# EasyEDA Pro project ProPrj_ADX_Core_v0_2026-04-30.epro

# Schematic Schematic

## Sheets
1 P1: Board Name: Board1; Create Date: 2026-04-08; Page Name: P1; Project Name: ADX_Core_v0; Schematic Name: Schematic; Update Date: 2026-04-29; Company: Furukawakikaku; Page Size: A4; Reviewed: Notebooklm; Version: V1.0
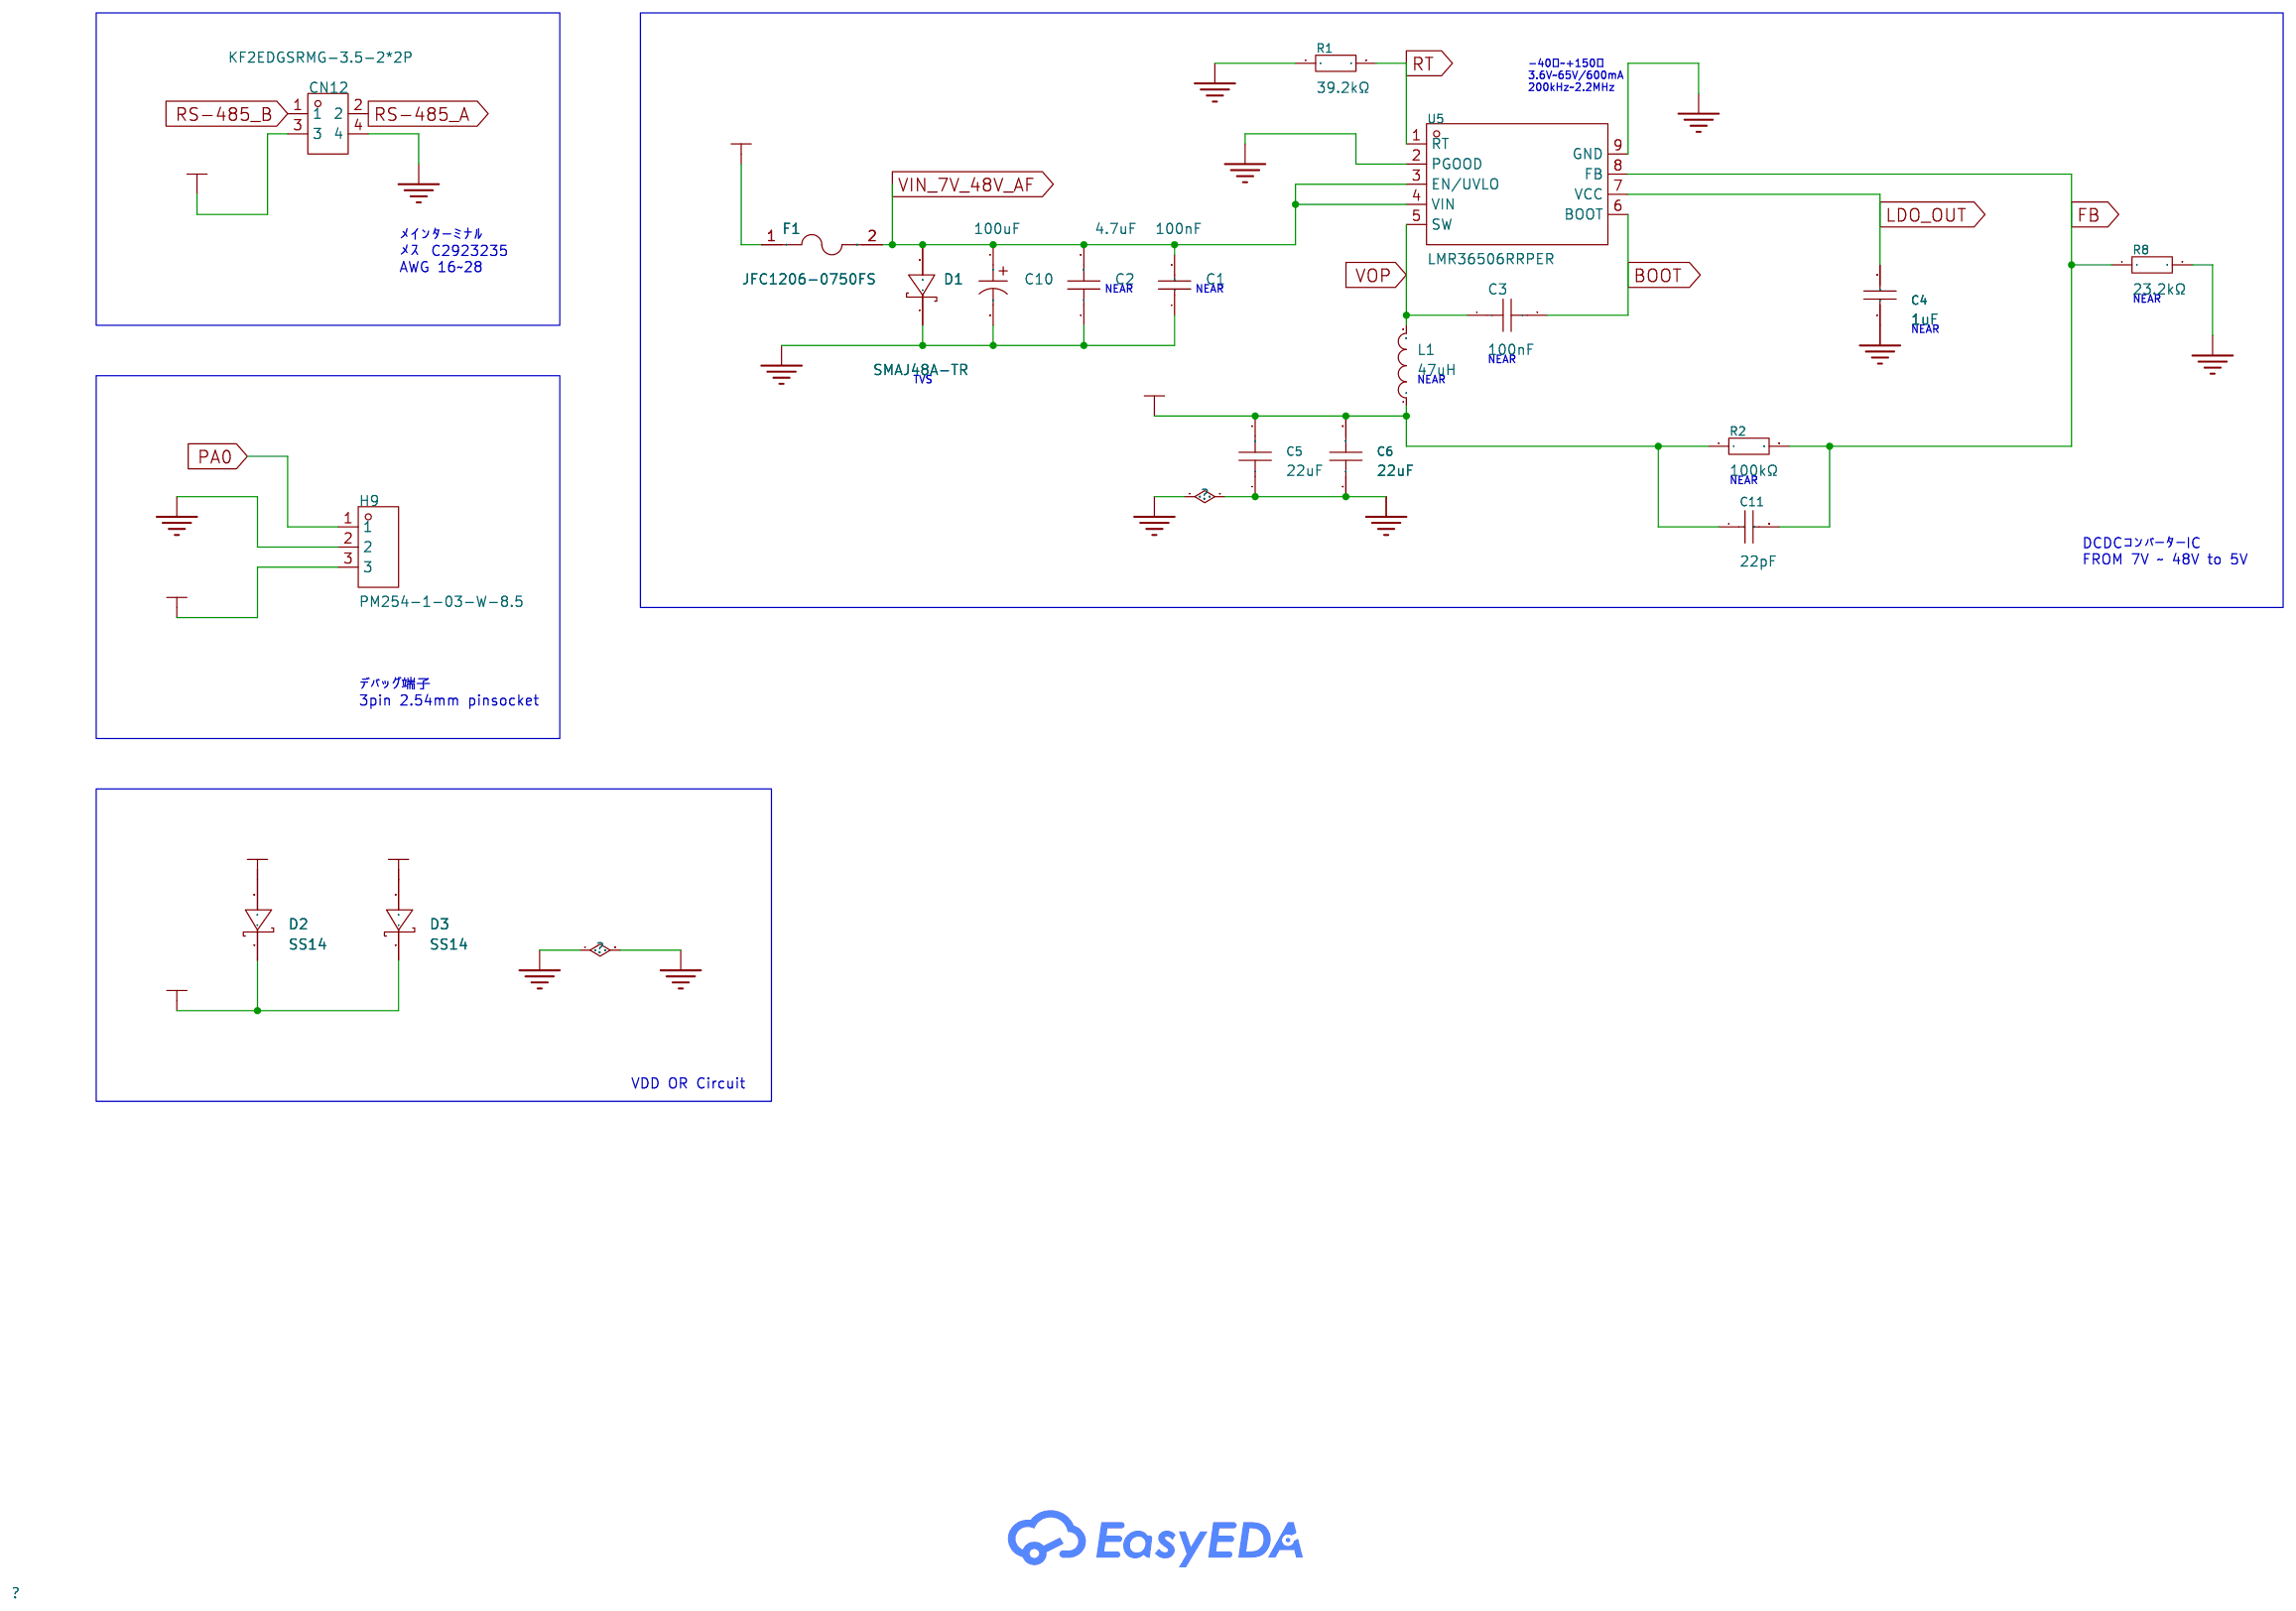
[diagram p0: P1]
2 P2: Page Name: P2; Company: Furukawakiakaku
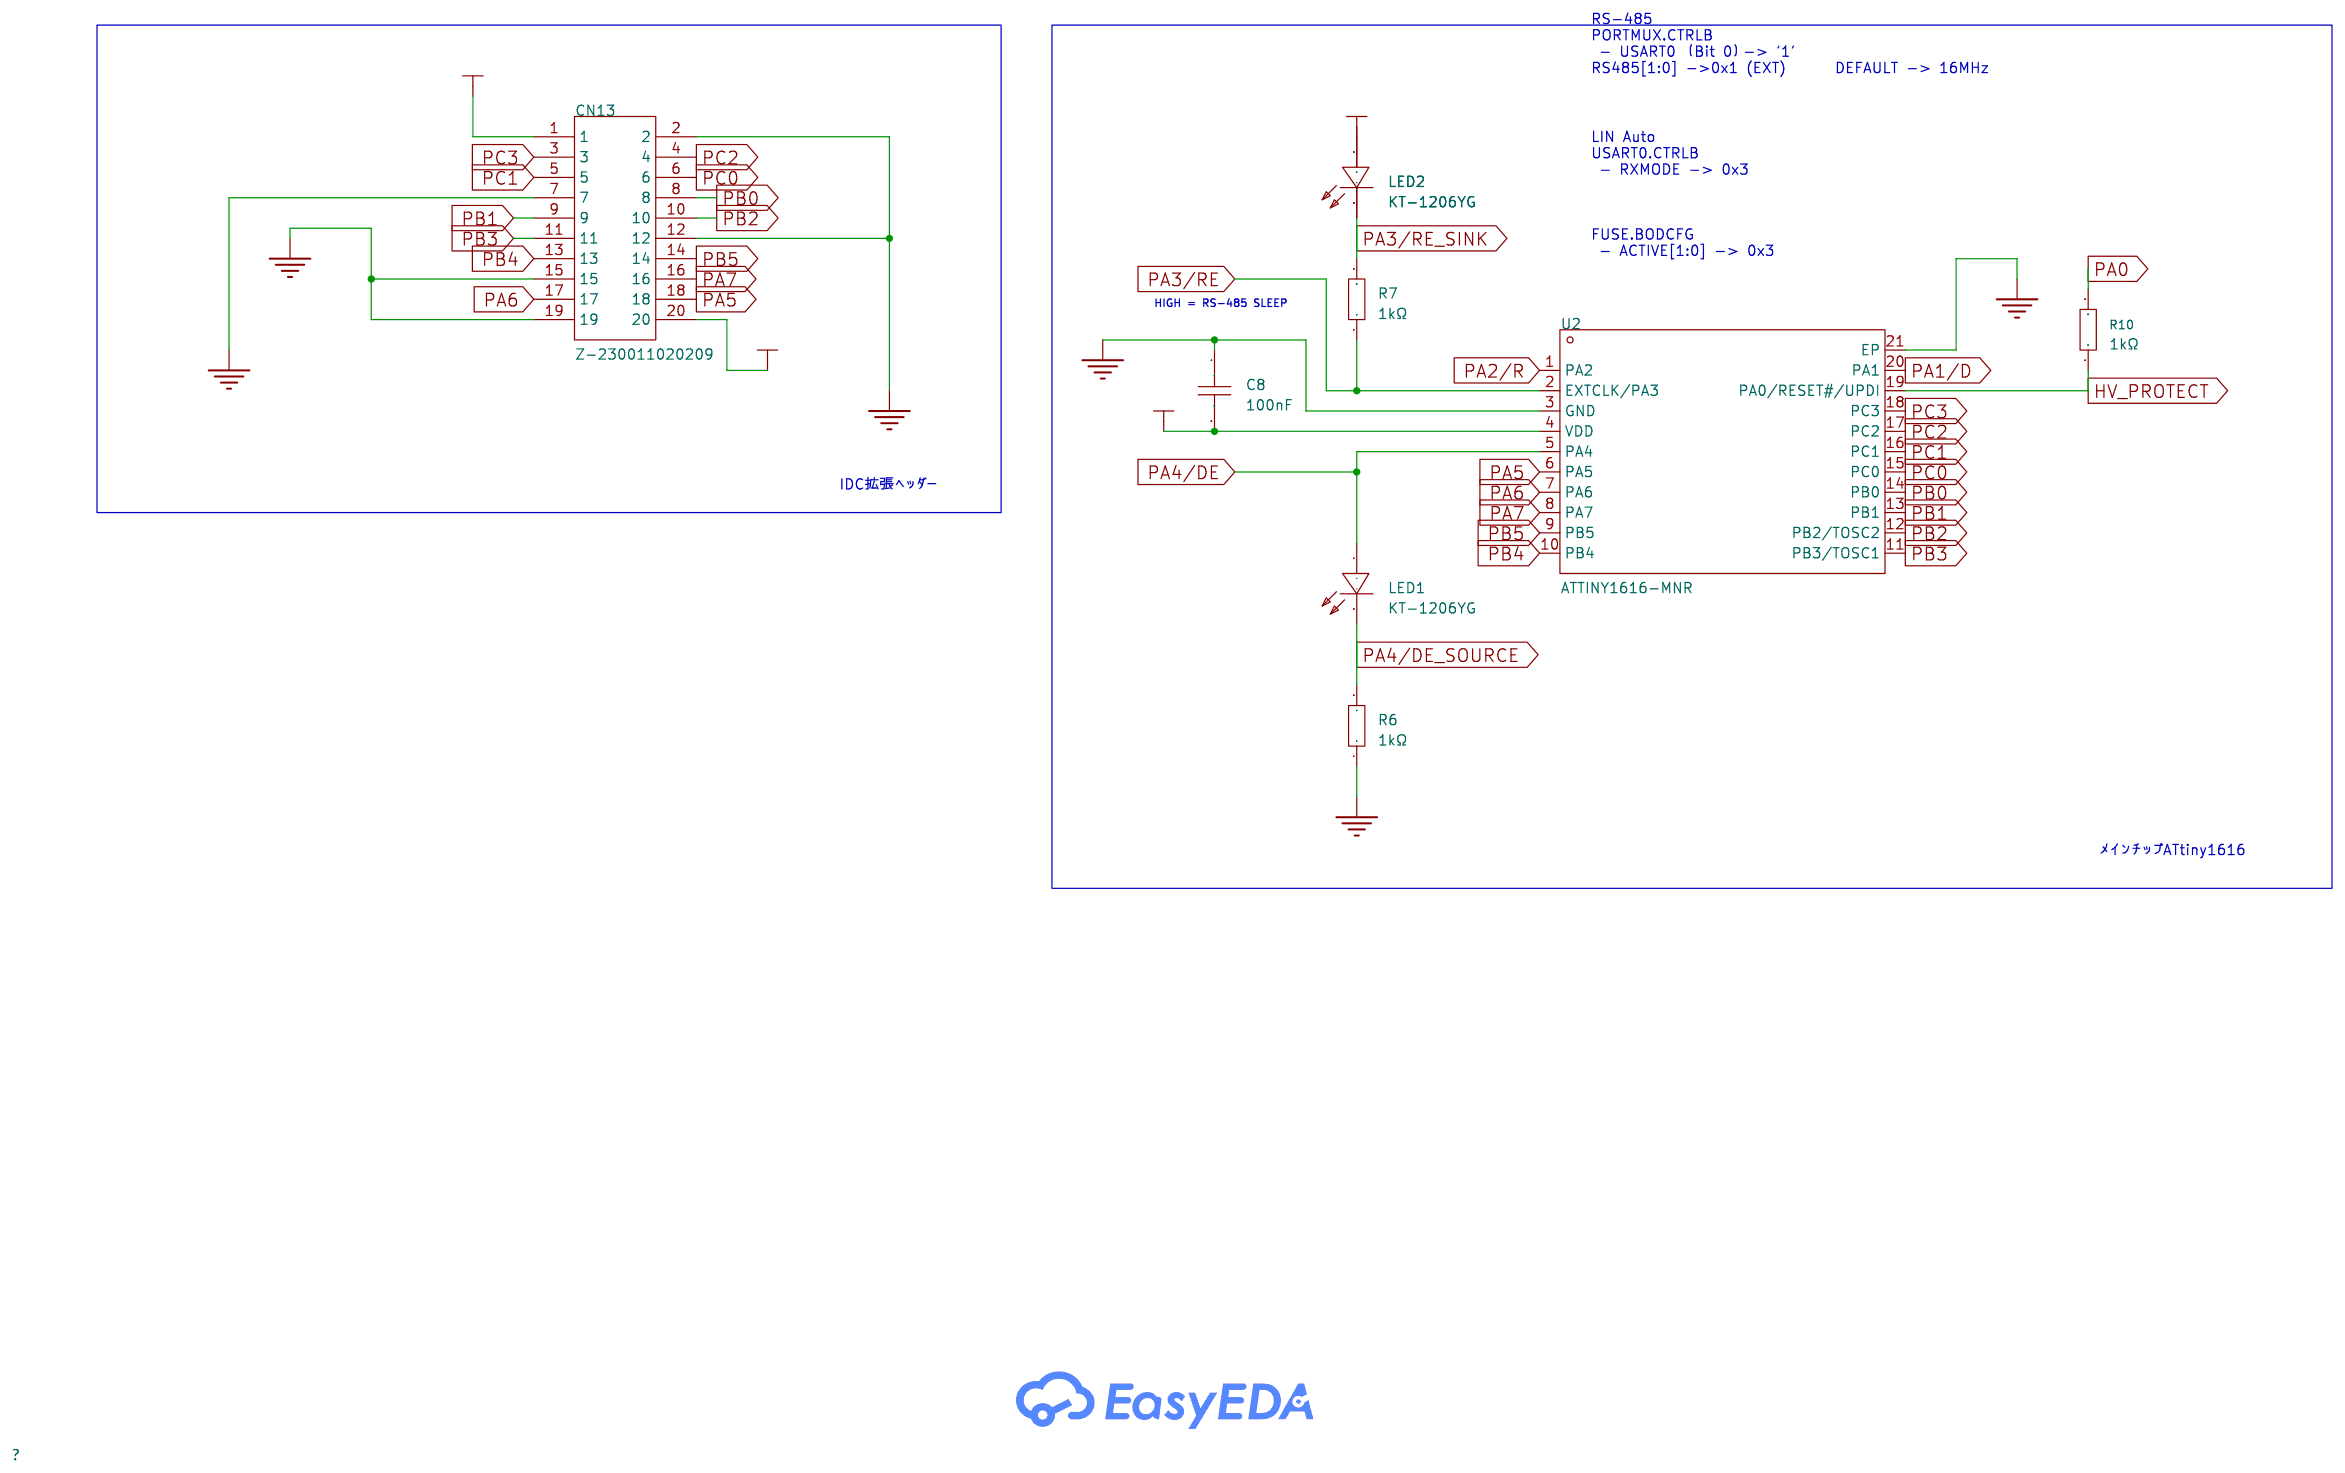
[diagram p1: P2]
3 P3: Create Date: 2026-04-29; Page Name: P3; Update Date: 2026-04-30; Company: EasyEDA.com
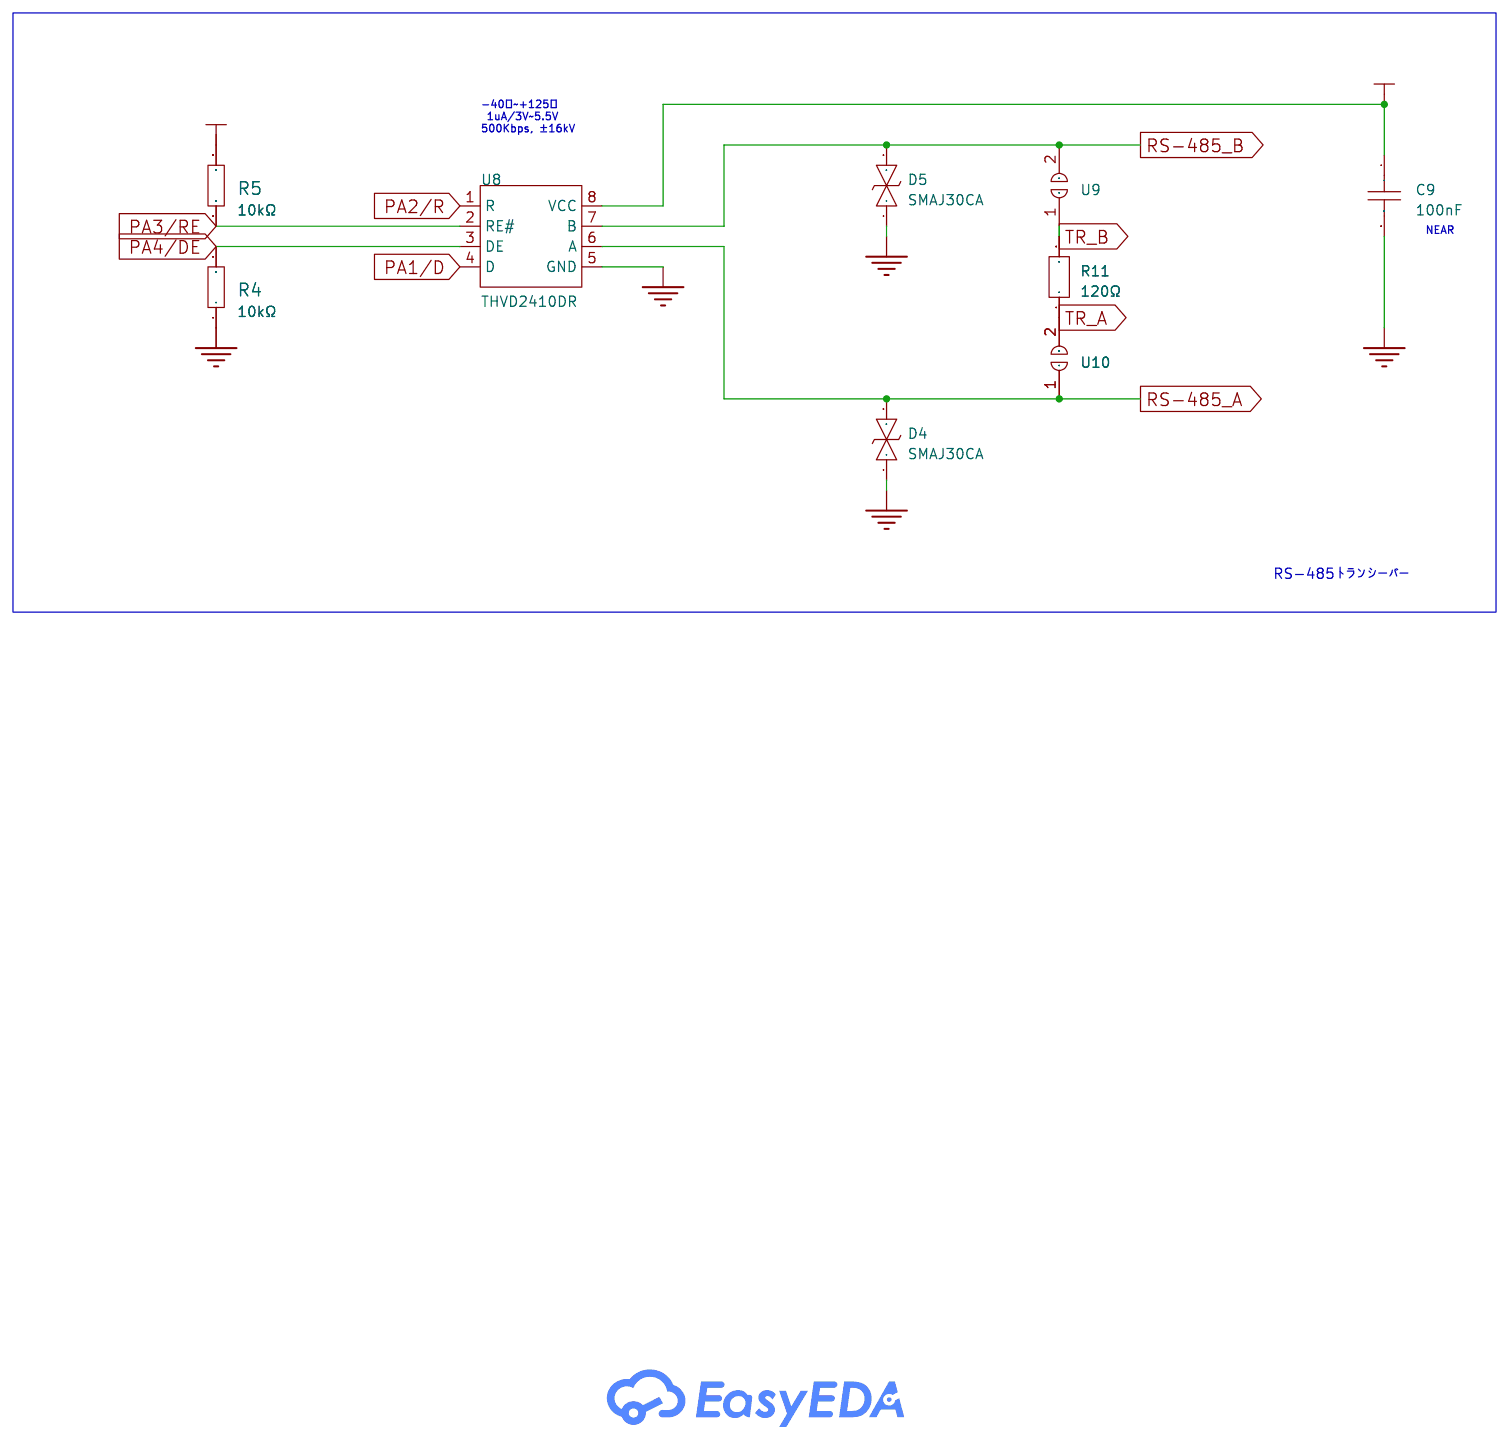
[diagram p2: P3]

## Parts
sheet P1
C1  100nF  [C0805]
C2  4.7uF  [C381466]
C3  100nF  [C1525]
C4  1uF  [C0805]
C5  22uF  [C21397]
C6  22uF  [C21397]
C10  100uF  [CAP-SMD_BD10.0-L10.3-W10.3-FD]
C11  22pF  [C0603]
CN12  KF2EDGSRMG-3.5-2*2P  [CONN-TH_4P-P3.50_KEFA_KF2EDGSRMG-3.5-2X2P]
D1  SMAJ48A-TR  [SMA_L4.3-W2.6-LS5.2-RD]
D2  SS14  [SMA_L4.2-W2.6-LS5.0-RD_1]
D3  SS14  [SMA_L4.2-W2.6-LS5.0-RD_1]
F1  JFC1206-0750FS  [F1206]
H9  PM254-1-03-W-8.5  [HDR-TH_3P-P2.54-H-F-W10.0-N]
L1  47uH  [IND-SMD_L7.0-W6.6_FXL0630]
R1  39.2kΩ  [R0402]
R2  100kΩ  [R0402]
R8  23.2kΩ  [R0402]
U5  LMR36506RRPER  [VQFN-9_L2.0-W2.0-P0.50-TL]
sheet P2
C8  100nF  [C1525]
CN13  Z-230011020209  [IDC-TH_20P-P2.54_Z-230011020209]
LED1  KT-1206YG  [LED-SMD_L3.2-W1.6_E6C1206YG]
LED2  KT-1206YG  [LED-SMD_L3.2-W1.6_E6C1206YG]
R6  1kΩ  [R0603]
R7  1kΩ  [R0603]
R10  1kΩ  [R1206]
U2  ATTINY1616-MNR  [QFN-20_L3.0-W3.0-P0.40-BL-EP1.7]
sheet P3
C9  100nF  [C1525]
D4  SMAJ30CA  [SMA_L4.4-W2.8-LS5.1-BI]
D5  SMAJ30CA  [SMA_L4.4-W2.8-LS5.1-BI]
R4  10kΩ  [R0603]
R5  10kΩ  [R0603]
R11  120Ω  [R1206]
U8  THVD2410DR  [SOIC-8_L4.9-W3.9-P1.27-LS6.0-TL]
U9  -  [Jumper]
U10  -  [Jumper]

## Library data of the parts
C1 = CL21B104KCFNNNE: Capacitance:100nF Tolerance:±10% Tolerance:±10% Voltage Rating:100V Temperature Coefficient:X7R; LCSC Part Name: 100nF ±10% 100V; Supplier Part: C28233; Manufacturer: SAMSUNG(三星); Supplier Footprint: 0805; JLCPCB Part Class: Basic Part; Datasheet: https://item.szlcsc.com/datasheet/CL21B104KCFNNNE/28983.html; Supplier: LCSC; Tolerance: ±10%; Voltage Rating: 100V; Temperature Coefficient: X7R
C2 = FS32X475K101EGG: Capacitance:4.7uF Tolerance:±10% Tolerance:±10% Voltage Rating:100V Temperature Coefficient:X7R; LCSC Part Name: 4.7uF ±10% 100V; Manufacturer: PSA(信昌电陶); Supplier Footprint: 1210; JLCPCB Part Class: Extended Part; Datasheet: https://item.szlcsc.com/datasheet/FS32X475K101EGG/354087.html; Supplier: LCSC; Tolerance: ±10%; Voltage Rating: 100V; Temperature Coefficient: X7R
C3 C8 C9 = CL05B104KO5NNNC: Capacitance:100nF Tolerance:±10% Tolerance:±10% Voltage Rating:16V Temperature Coefficient:X7R; LCSC Part Name: 100nF ±10% 16V; Manufacturer: SAMSUNG(三星); Supplier Footprint: 0402; JLCPCB Part Class: Basic Part; Datasheet: https://item.szlcsc.com/datasheet/CL05B104KO5NNNC/1877.html; Supplier: LCSC; Tolerance: ±10%; Voltage Rating: 16V; Temperature Coefficient: X7R
C4 = CL21B105KBFNNNE: Capacitance:1uF Tolerance:±10% Tolerance:±10% Voltage Rating:50V Temperature Coefficient:X7R; LCSC Part Name: 1uF ±10% 50V; Supplier Part: C28323; Manufacturer: SAMSUNG(三星); Supplier Footprint: 0805; JLCPCB Part Class: Basic Part; Datasheet: https://item.szlcsc.com/datasheet/CL21B105KBFNNNE/29074.html; Supplier: LCSC; Tolerance: ±10%; Voltage Rating: 50V; Temperature Coefficient: X7R
C5 C6 = GRM32ER71E226KE15L: Capacitance: Tolerance:±10% Tolerance:±10% Voltage Rated: Temperature Coefficient:; LCSC Part Name: 22uF ±10% 25V; Manufacturer: muRata(村田); Supplier Footprint: 1210; JLCPCB Part Class: Extended Part; Datasheet: https://atta.szlcsc.com/upload/public/pdf/source/20230811/6AA9DB9766E5496748A2F980D0C94A94.pdf; Supplier: LCSC; Tolerance: ±10%
C10 = EFVH100ADA101M10C0: Capacitance:100uF Tolerance:±20% Tolerance:±20% Voltage Rating:100V Diameter:10mm Height - Seated (Max):12.5mm Operating Temperature:-55℃~+105℃ Operating Temperature:-55℃~+105℃; LCSC Part Name: 100uF ±20% 100V; Supplier Part: C22387799; Manufacturer: FOLLON(富隆电子); Supplier Footprint: SMD,D10xL12.5mm; JLCPCB Part Class: Extended Part; Datasheet: https://item.szlcsc.com/datasheet/EFVH100ADA101M10C0/23952399.html; Supplier: LCSC; Tolerance: ±20%; Voltage Rating: 100V; Diameter: 10mm; Height - Seated (Max): 12.5mm; Operating Temperature: -55℃~+105℃
C11 = CC0603JRNPO9BN220: Capacitance:22pF Tolerance:±5% Tolerance:±5% Voltage Rating:50V Temperature Coefficient:NP0; LCSC Part Name: 22pF ±5% 50V; Supplier Part: C105620; Manufacturer: YAGEO(国巨); Supplier Footprint: 0603; JLCPCB Part Class: Extended Part; Datasheet: https://item.szlcsc.com/datasheet/CC0603JRNPO9BN220/106835.html; Supplier: LCSC; Tolerance: ±5%; Voltage Rating: 50V; Temperature Coefficient: NP0
CN12 = KF2EDGSRMG-3.5-2*2P: Connector Type:Board Side/Socket - Closed Termination Style:Screw；Hinged (Snap On) Number of Positions or Pins:2x2P Pitch:3.5mm Color:Black Mounting Type:Right-Angle Number of Pins:4P Number of Rows:2 Number of PINs Per Row:2 Current Rating:10A Voltage Ra; LCSC Part Name: 螺丝固定 卡扣固定 2x2P 3.5mm 排数:2 每排P数:2; Supplier Part: C2923269; Manufacturer: KEFA(科发); Supplier Footprint: 弯插,P=3.5mm; JLCPCB Part Class: Extended Part; Datasheet: https://item.szlcsc.com/datasheet/KF2EDGSRMG-3.5-2*2P/3234727.html; Supplier: LCSC; Connector Type: Board Side/Socket - Closed; Termination Style: Screw；Hinged (Snap On); Number of Positions or Pins: 2x2P; Pitch: 3.5mm; Color: Black; Mounting Type: Right-Angle; Number of Pins: 4P; Number of Rows: 2; Number of PINs Per Row: 2; Current Rating: 10A; Voltage Rating (Max): 300V; Operating Temperature: -40℃~+105℃
D1 = SMAJ48A-TR: Polarity:Unidirectional Reverse Stand-Off Voltage (Vrwm):48V Clamping Voltage:100V Peak Pulse Current (Ipp):23A@8/20us Peak Pulse Power Dissipation (Ppp):400W Voltage - Breakdown:56.1V Reverse Leakage Current (Ir):1uA Operating Temperature:-55℃~+150℃ Oper; LCSC Part Name: 单向TVS 48V截止 23A峰值脉冲; Supplier Part: C1973855; Manufacturer: ST(意法半导体); Supplier Footprint: SMA(DO-214AC); JLCPCB Part Class: Extended Part; Datasheet: https://item.szlcsc.com/datasheet/SMAJ48A-TR/2065393.html; Supplier: LCSC; Polarity: Unidirectional; Reverse Stand-Off Voltage (Vrwm): 48V; Clamping Voltage: 100V; Peak Pulse Current (Ipp): 23A@8/20us; Peak Pulse Power Dissipation (Ppp): 400W; Voltage - Breakdown: 56.1V; Reverse Leakage Current (Ir): 1uA; Operating Temperature: -55℃~+150℃; level of protection: IEC 61000-4-5；IEC 61000-4-2; Type: TVS
D2 D3 = SS14_C2480: Diode Configuration:Independent Voltage - Forward(Vf@If):550mV@1A Voltage - DC Reverse(Vr):40V Current - Rectified:1A Reverse Leakage Current (Ir):300uA@40V Operating Junction Temperature Range:-55℃~+150℃ Operating Junction Temperature Range:-55℃~+150℃ No; LCSC Part Name: 电压:40V 电流:1A; Supplier Part: C2480; Manufacturer: MDD(辰达半导体); Supplier Footprint: SMA(DO-214AC); JLCPCB Part Class: Basic Part; Datasheet: https://item.szlcsc.com/datasheet/SS14/2857.html; Supplier: LCSC; Diode Configuration: Independent; Voltage - Forward(Vf@If): 550mV@1A; Voltage - DC Reverse(Vr): 40V; Current - Rectified: 1A; Reverse Leakage Current (Ir): 300uA@40V; Operating Junction Temperature Range: -55℃~+150℃; Non-Repetitive Peak Forward Surge Current: 25A
F1 = JFC1206-0750FS: Type:Surface Mount Fuse Current Rating:750mA Voltage Rating (AC):63V Voltage Rating (DC):63V Operating Temperature:-55℃~+125℃ Operating Temperature:-55℃~+125℃ Melting I2t:0.0057 Interrupt Rating:50A Length:3.2mm Width:1.6mm; LCSC Part Name: 贴片式保险丝; Supplier Part: C136342; Manufacturer: JDTfuse(集电通); Supplier Footprint: 1206; JLCPCB Part Class: Extended Part; Datasheet: https://item.szlcsc.com/datasheet/JFC1206-0750FS/147657.html; Supplier: LCSC; Type: Surface Mount Fuse; Current Rating: 750mA; Voltage Rating (AC): 63V; Voltage Rating (DC): 63V; Operating Temperature: -55℃~+125℃; Melting I2t: 0.0057; Interrupt Rating: 50A; Length: 3.2mm; Width: 1.6mm
H9 = PM254-1-03-W-8.5: Holes Structure:1x3P Pitch:2.54mm Row Spacing:- Circular Hole / Square Hole:Square Hole Mounting Type:Right Angle Number of Rows:1 Number of Positions:3P Current Rating:3A Voltage Rating (Max):- Holes Direction:Side Insulation Height:8.5mm Contact Materia; LCSC Part Name: 1x3P 间距:2.54mm 弯插; Supplier Part: C2897385; Manufacturer: HCTL(华灿天禄); Supplier Footprint: 弯插,P=2.54mm; JLCPCB Part Class: Extended Part; Datasheet: https://item.szlcsc.com/datasheet/PM254-1-03-W-8.5/3142390.html; Supplier: LCSC; Holes Structure: 1x3P; Pitch: 2.54mm; Circular Hole / Square Hole: Square Hole; Mounting Type: Right Angle; Number of Rows: 1; Number of Positions: 3P; Current Rating: 3A; Holes Direction: Side; Insulation Height: 8.5mm; Contact Material: Copper Alloy; Operating Temperature: -40℃~+105℃
L1 = FXL0630-470-M: Inductance: Tolerance:±20% Tolerance:±20% Rated Current: Saturation Current (Isat):2A DC Resistance (DCR): Type:Integrated molded inductor; LCSC Part Name: 47uH ±20% 2A; Supplier Part: C475913; Manufacturer: cjiang(长江微电); Supplier Footprint: SMD,6.6x7mm; JLCPCB Part Class: Extended Part; Datasheet: https://atta.szlcsc.com/upload/public/pdf/source/20240426/3189EA8206330E2108542F9E34E540E7.pdf; Supplier: LCSC; Tolerance: ±20%; Saturation Current (Isat): 2A; Type: Integrated molded inductor
R1 = 0402WGF3922TCE: Type:Thick Film Resistor Resistance:39.2kΩ Tolerance:±1% Tolerance:±1% Power(Watts):62.5mW Voltage-Supply(Max):50V Temperature Coefficient:±100ppm/℃ Temperature Coefficient:±100ppm/℃ Operating Temperature:-55℃~+155℃ Operating Temperature:-55℃~+155℃; LCSC Part Name: 39.2kΩ ±1% 62.5mW 厚膜电阻; Supplier Part: C57106; Manufacturer: UNI-ROYAL(厚声); Supplier Footprint: 0402; JLCPCB Part Class: Extended Part; Datasheet: https://item.szlcsc.com/datasheet/0402WGF3922TCE/58137.html; Supplier: LCSC; Type: Thick Film Resistor; Tolerance: ±1%; Power(Watts): 62.5mW; Voltage-Supply(Max): 50V; Temperature Coefficient: ±100ppm/℃; Operating Temperature: -55℃~+155℃
R2 = 0402WGF1003TCE: Type:Thick Film Resistor Resistance:100kΩ Tolerance:±1% Tolerance:±1% Power(Watts):62.5mW Voltage-Supply(Max):50V Temperature Coefficient:±100ppm/℃ Temperature Coefficient:±100ppm/℃ Operating Temperature:-55℃~+155℃ Operating Temperature:-55℃~+155℃; LCSC Part Name: 100kΩ ±1% 62.5mW 厚膜电阻; Supplier Part: C25741; Manufacturer: UNI-ROYAL(厚声); Supplier Footprint: 0402; JLCPCB Part Class: Basic Part; Datasheet: https://item.szlcsc.com/datasheet/0402WGF1003TCE/26484.html; Supplier: LCSC; Type: Thick Film Resistor; Tolerance: ±1%; Power(Watts): 62.5mW; Voltage-Supply(Max): 50V; Temperature Coefficient: ±100ppm/℃; Operating Temperature: -55℃~+155℃
R8 = 0402WGF2322TCE: Type:Thick Film Resistor Resistance:23.2kΩ Tolerance:±1% Tolerance:±1% Power(Watts):62.5mW Voltage-Supply(Max):50V Temperature Coefficient:±100ppm/℃ Temperature Coefficient:±100ppm/℃ Operating Temperature:-55℃~+155℃ Operating Temperature:-55℃~+155℃; LCSC Part Name: 23.2kΩ ±1% 62.5mW 厚膜电阻; Supplier Part: C25873; Manufacturer: UNI-ROYAL(厚声); Supplier Footprint: 0402; JLCPCB Part Class: Extended Part; Datasheet: https://item.szlcsc.com/datasheet/0402WGF2322TCE/26616.html; Supplier: LCSC; Type: Thick Film Resistor; Tolerance: ±1%; Power(Watts): 62.5mW; Voltage-Supply(Max): 50V; Temperature Coefficient: ±100ppm/℃; Operating Temperature: -55℃~+155℃
U5 = LMR36506RRPER: Supplier Part: C2870127; Manufacturer: TI(德州仪器); Supplier Footprint: VQFN-9(2x2); JLCPCB Part Class: Extended Part; Datasheet: https://www.ti.com/cn/lit/gpn/lmr36506; Supplier: LCSC
CN13 = Z-230011020209: Connector Type:Horn buckle Pitch:2.54mm Structure:2x10P Holder Type:Right-Angle Row Spacing:2.54mm Number of Rows:2 Pin Number in each Row:10 Contact Material:Copper Alloy Contact Plating:Gold; LCSC Part Name: 2.54mm 2x10P 排数:2 每排P数:10 黑色; Supplier Part: C221002; Manufacturer: Nextron(正凌); Supplier Footprint: 弯插,P=2.54mm; JLCPCB Part Class: Extended Part; Datasheet: https://atta.szlcsc.com/upload/public/pdf/source/20180731/C221012_6A24CDA93994749D0946806D4F08BD76.pdf; Supplier: LCSC; Connector Type: Horn buckle; Pitch: 2.54mm; Structure: 2x10P; Holder Type: Right-Angle; Row Spacing: 2.54mm; Number of Rows: 2; Pin Number in each Row: 10; Contact Material: Copper Alloy; Contact Plating: Gold
LED1 LED2 = KT-1206YG: Illumination Color:Yellow Green Voltage - Forward(Vf):1.8V~2.4V Voltage - Forward(Vf):1.8V~2.4V Power(Watts):48mW Forward Current:20mA Wavelength - Dominant:568nm~576nm Wavelength - Dominant:568nm~576nm Peak Wavelength:576nm Diode Configuration:Discrete D; LCSC Part Name: 1206 黄绿 普绿; Supplier Part: C15595; Manufacturer: KENTO; Supplier Footprint: 1206; JLCPCB Part Class: Extended Part; Datasheet: https://item.szlcsc.com/datasheet/KT-1206YG/16274.html; Supplier: LCSC; Illumination Color: Yellow Green; Voltage - Forward(Vf): 1.8V~2.4V; Power(Watts): 48mW; Forward Current: 20mA; Wavelength - Dominant: 568nm~576nm; Peak Wavelength: 576nm; Diode Configuration: Discrete Diode; Lens Color: Water Clear; Luminous Intensity: 70mcd; Viewing Angle: 120°; Operating Temperature: -40℃~+105℃
R6 R7 = 0603WAF1001T5E: Type:Thick Film Resistor Resistance:1kΩ Tolerance:±1% Tolerance:±1% Power(Watts):100mW Voltage-Supply(Max):75V Temperature Coefficient:±100ppm/℃ Temperature Coefficient:±100ppm/℃ Operating Temperature:-55℃~+155℃ Operating Temperature:-55℃~+155℃; LCSC Part Name: 1kΩ ±1% 100mW 厚膜电阻; Supplier Part: C21190; Manufacturer: UNI-ROYAL(厚声); Supplier Footprint: 0603; JLCPCB Part Class: Basic Part; Datasheet: https://item.szlcsc.com/datasheet/0603WAF1001T5E/21904.html; Supplier: LCSC; Type: Thick Film Resistor; Tolerance: ±1%; Power(Watts): 100mW; Voltage-Supply(Max): 75V; Temperature Coefficient: ±100ppm/℃; Operating Temperature: -55℃~+155℃
R10 = 1206W4F1001T5E_C4410: Type:Thick Film Resistor Resistance:1kΩ Tolerance:±1% Tolerance:±1% Power(Watts):250mW Voltage-Supply(Max):200V Temperature Coefficient:±100ppm/℃ Temperature Coefficient:±100ppm/℃ Operating Temperature:-55℃~+155℃ Operating Temperature:-55℃~+155℃; LCSC Part Name: 1kΩ ±1% 250mW 厚膜电阻; Supplier Part: C4410; Manufacturer: UNI-ROYAL(厚声); Manufacturer Part: 1206W4F1001T5E; Supplier Footprint: 1206; JLCPCB Part Class: Basic Part; Datasheet: https://item.szlcsc.com/datasheet/1206W4F1001T5E/4817.html; Supplier: LCSC; Type: Thick Film Resistor; Tolerance: ±1%; Power(Watts): 250mW; Voltage-Supply(Max): 200V; Temperature Coefficient: ±100ppm/℃; Operating Temperature: -55℃~+155℃
U2 = ATTINY1616-MNR: CPU Core:AVR CPU Maximum Speed:20MHz Program Storage Size:16KB Program Memory Type:FLASH Number of I/O:18 ADC (Bit):10bit DAC (Bit):8bit Voltage - Supply:1.8V~5.5V Voltage - Supply:1.8V~5.5V Applications:-; LCSC Part Name: tinyAVR 1系列处理器; Supplier Part: C507118; Manufacturer: MICROCHIP(美国微芯); Supplier Footprint: QFN-20-EP(3x3); JLCPCB Part Class: Extended Part; Datasheet: https://item.szlcsc.com/datasheet/ATTINY1616-MNR/520766.html; Supplier: LCSC; CPU Core: AVR; CPU Maximum Speed: 20MHz; Program Storage Size: 16KB; Program Memory Type: FLASH; Number of I/O: 18; ADC (Bit): 10bit; DAC (Bit): 8bit; Voltage - Supply: 1.8V~5.5V
D4 D5 = SMAJ30CA_C908828: Polarity:Bidirectional Reverse Stand-Off Voltage (Vrwm):30V Clamping Voltage:48.4V Peak Pulse Current (Ipp):8.3A Peak Pulse Power Dissipation (Ppp):400W Voltage - Breakdown:33.3V Reverse Leakage Current (Ir):5uA Operating Temperature:-55℃~+150℃@(Tj) Opera; LCSC Part Name: 双向TVS 30V截止 8.3A峰值脉冲; Supplier Part: C908828; Manufacturer: GOODWORK(固得沃克); Supplier Footprint: DO-214AC(SMA); JLCPCB Part Class: Extended Part; Datasheet: https://item.szlcsc.com/datasheet/SMAJ30CA/975580.html; Supplier: LCSC; Polarity: Bidirectional; Reverse Stand-Off Voltage (Vrwm): 30V; Clamping Voltage: 48.4V; Peak Pulse Current (Ipp): 8.3A; Peak Pulse Power Dissipation (Ppp): 400W; Voltage - Breakdown: 33.3V; Reverse Leakage Current (Ir): 5uA; Operating Temperature: -55℃~+150℃@(Tj); Type: TVS
R4 R5 = 0603WAF1002T5E: Type:Thick Film Resistor Resistance:10kΩ Tolerance:±1% Tolerance:±1% Power(Watts):100mW Voltage-Supply(Max):75V Temperature Coefficient:±100ppm/℃ Temperature Coefficient:±100ppm/℃ Operating Temperature:-55℃~+155℃ Operating Temperature:-55℃~+155℃; LCSC Part Name: 厚膜电阻 10kΩ ±1% 100mW; Supplier Part: C25804; Manufacturer: UNI-ROYAL(厚声); Supplier Footprint: 0603; JLCPCB Part Class: Basic Part; Datasheet: https://item.szlcsc.com/datasheet/0603WAF1002T5E/26547.html; Supplier: LCSC; Type: Thick Film Resistor; Tolerance: ±1%; Power(Watts): 100mW; Voltage-Supply(Max): 75V; Temperature Coefficient: ±100ppm/℃; Operating Temperature: -55℃~+155℃
R11 = FRC1206F1200TS: Type:Thick Film Resistor Resistance:120Ω Tolerance:±1% Tolerance:±1% Power(Watts):250mW Voltage-Supply(Max):200V Temperature Coefficient:±100ppm/℃ Temperature Coefficient:±100ppm/℃ Operating Temperature:-55℃~+155℃ Operating Temperature:-55℃~+155℃; LCSC Part Name: 120Ω ±1% 250mW 厚膜电阻; Supplier Part: C2933584; Manufacturer: FOJAN(富捷); Supplier Footprint: 1206; JLCPCB Part Class: Extended Part; Supplier: LCSC; Type: Thick Film Resistor; Tolerance: ±1%; Power(Watts): 250mW; Voltage-Supply(Max): 200V; Temperature Coefficient: ±100ppm/℃; Operating Temperature: -55℃~+155℃
U8 = THVD2410DR: Type:Transceiver Number of Drivers:1 Number of Receivers:1 Voltage - Supply:3V~5.5V Voltage - Supply:3V~5.5V Data Rate:500Kbps Data Rate:500Kbps Number of Nodes:256 ESD Protect:±16kV ESD Protect:±16kV Operating Temperature:-40℃~+125℃ Operating Temperature; LCSC Part Name: THVD2410半双工RS-485收发器; Supplier Part: C1849398; Manufacturer: TI(德州仪器); Supplier Footprint: SOIC-8; JLCPCB Part Class: Extended Part; Datasheet: https://www.ti.com/cn/lit/gpn/thvd2450; Supplier: LCSC; Type: Transceiver; Number of Drivers: 1; Number of Receivers: 1; Voltage - Supply: 3V~5.5V; Data Rate: 500Kbps; Number of Nodes: 256; ESD Protect: ±16kV; Operating Temperature: -40℃~+125℃; Supply Current (Iq): 1uA; Communication Mode: Half-Duplex
U9 U10 = Jumper: _: 3

## Nets
GND_5V: C1.1 C2.1 C4.1 C5.1 C6.1 C8.1 C9.2 C10.2 CN12.4 CN13.2 CN13.7 CN13.12 CN13.15 CN13.19 D1.1(A) D4.1 D5.1 H9.2 R1.1 R4.1 R6.1 R8.2 U2.3(GND) U2.21(EP) U5.2(PGOOD) U5.9(GND) U8.5(GND)
VDD: C8.2 C9.1 CN13.1 CN13.20 D2.1(K) D3.1(K) LED2.1(+) R5.2 U2.4(VDD) U8.8(VCC)
VDD_5V3: C5.2 C6.2 C11.1 D3.2(A) L1.1 R2.1
VDD_DEBUG: D2.2(A) H9.3
VIN_7V_48V: CN12.3 F1.1
VIN_7V_48V_AF: C1.2 C2.2 C10.1 D1.2(K) F1.2 U5.3(EN/UVLO) U5.4(VIN)
BOOT: C3.2 U5.6(BOOT)
FB: C11.2 R2.2 R8.1 U5.8(FB)
HV_PROTECT: R10.1 U2.19(PA0/RESET#/UPDI)
LDO_OUT: C4.2 U5.7(VCC)
PA0: H9.1 R10.2
PA1/D: U2.20(PA1) U8.4(D)
PA2/R: U2.1(PA2) U8.1(R)
PA3/RE: R5.1 R7.1 U2.2(EXTCLK/PA3) U8.2(RE#)
PA3/RE_SINK: LED2.2(-) R7.2
PA4/DE: LED1.1(+) R4.2 U2.5(PA4) U8.3(DE)
PA4/DE_SOURCE: LED1.2(-) R6.2
PA5: CN13.18 U2.6(PA5)
PA6: CN13.17 U2.7(PA6)
PA7: CN13.16 U2.8(PA7)
PB0: CN13.8 U2.14(PB0)
PB1: CN13.9 U2.13(PB1)
PB2: CN13.10 U2.12(PB2/TOSC2)
PB3: CN13.11 U2.11(PB3/TOSC1)
PB4: CN13.13 U2.10(PB4)
PB5: CN13.14 U2.9(PB5)
PC0: CN13.6 U2.15(PC0)
PC1: CN13.5 U2.16(PC1)
PC2: CN13.4 U2.17(PC2)
PC3: CN13.3 U2.18(PC3)
RS-485_A: CN12.2 D4.2 U8.6(A) U10.1
RS-485_B: CN12.1 D5.2 U8.7(B) U9.2
RT: R1.2 U5.1(RT)
TR_A: R11.1 U10.2
TR_B: R11.2 U9.1
VOP: C3.1 L1.2 U5.5(SW)

## Notes on the sheets
sheet 1
- -40℃~+150℃
  3.6V~65V/600mA
  200kHz~2.2MHz
- メインターミナル
  メス　C2923235
  AWG 16~28
- NEAR
- NEAR
- NEAR
- NEAR
- NEAR
- TVS
- NEAR
- NEAR
- DCDCコンバーターIC
  FROM 7V ~ 48V to 5V
- デバッグ端子
  3pin 2.54mm pinsocket
- VDD OR Circuit
sheet 2
- RS-485
  PORTMUX.CTRLB
   - USART0 （Bit 0）-> '1'
  RS485[1:0] ->0x1 (EXT)
- DEFAULT -> 16MHz
- LIN Auto
  USART0.CTRLB
   - RXMODE -> 0x3
- FUSE.BODCFG
   - ACTIVE[1:0] -> 0x3
- HIGH = RS-485 SLEEP
- IDC拡張ヘッダー
- メインチップATtiny1616
sheet 3
- -40℃~+125℃
   1uA/3V~5.5V
  500Kbps, ±16kV
- NEAR
- RS-485トランシーバー

# Board PCB1
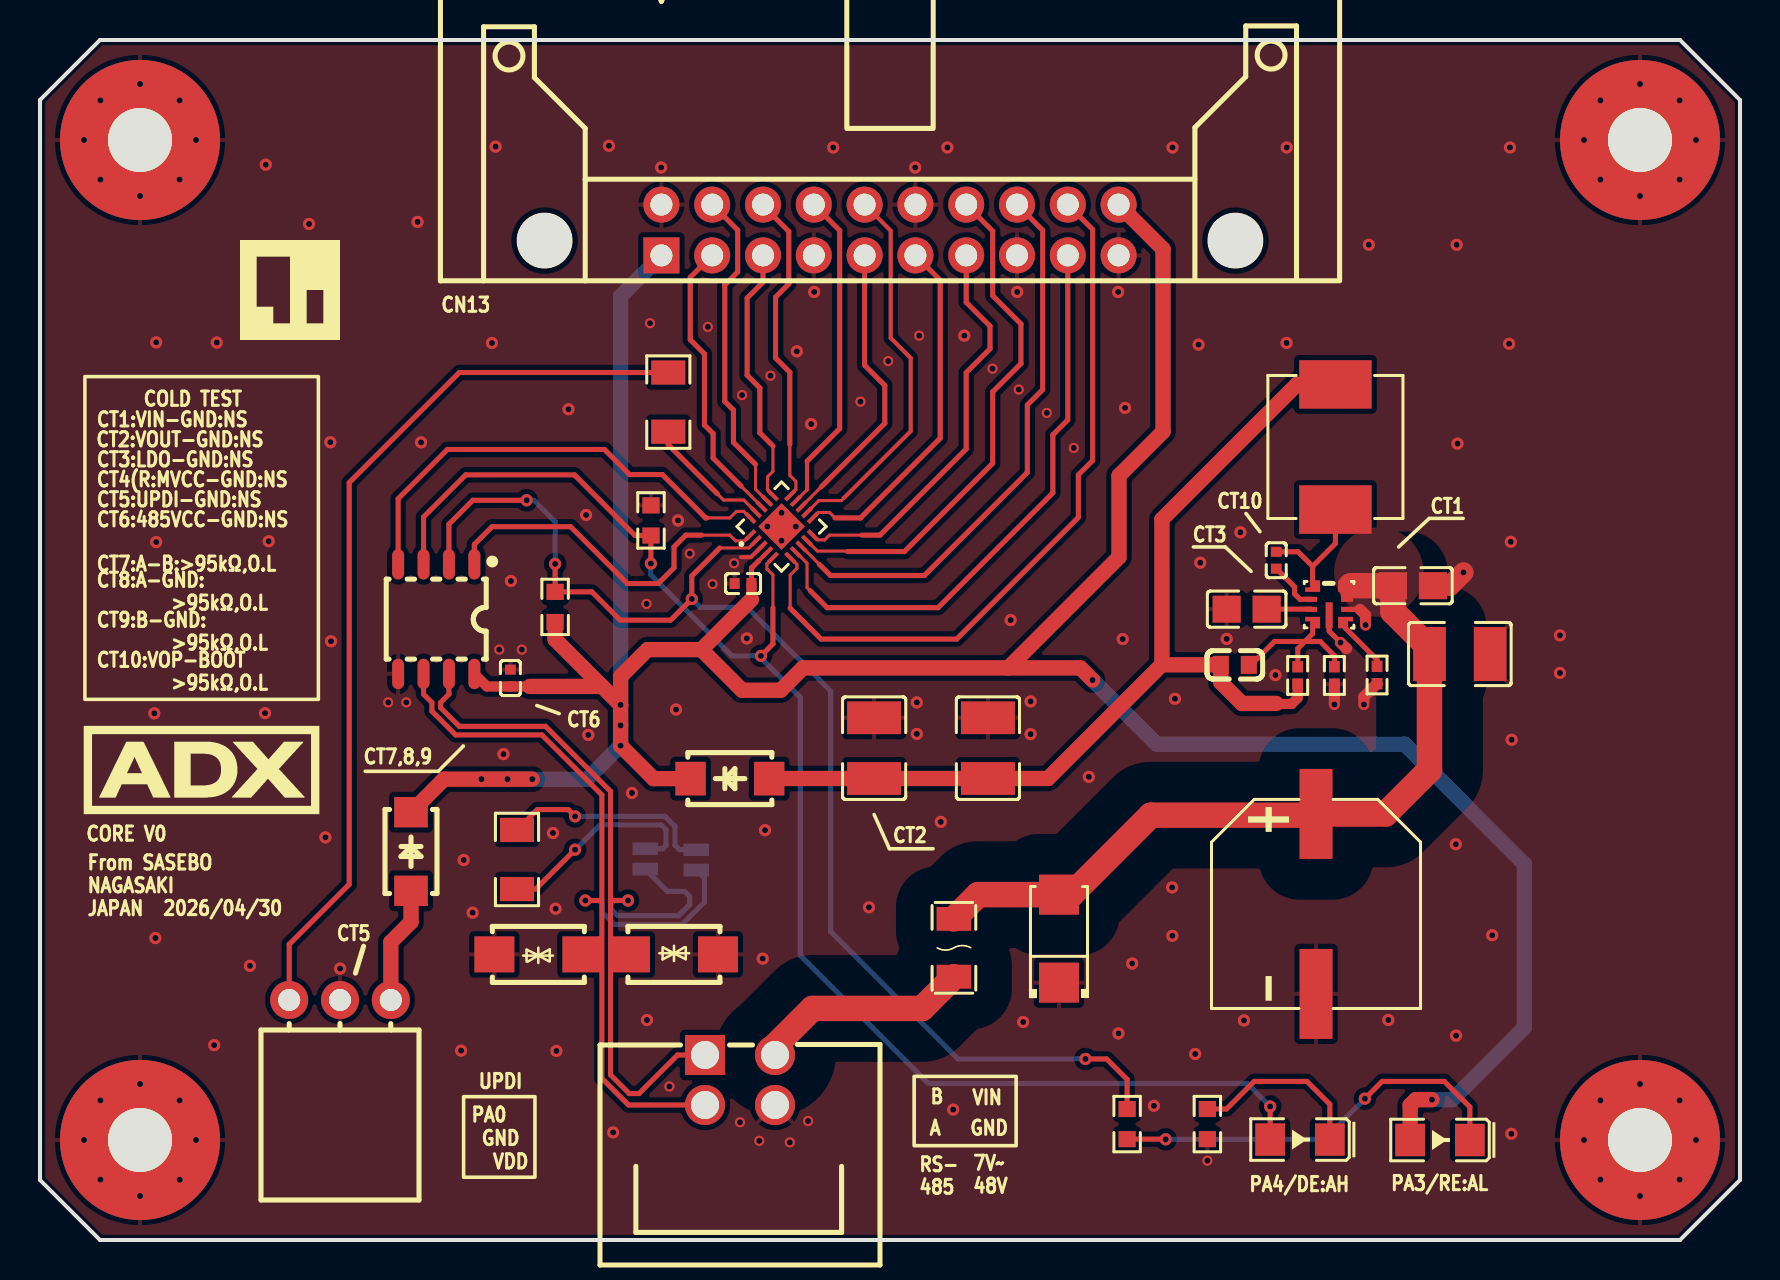
[diagram p3: board, top side]
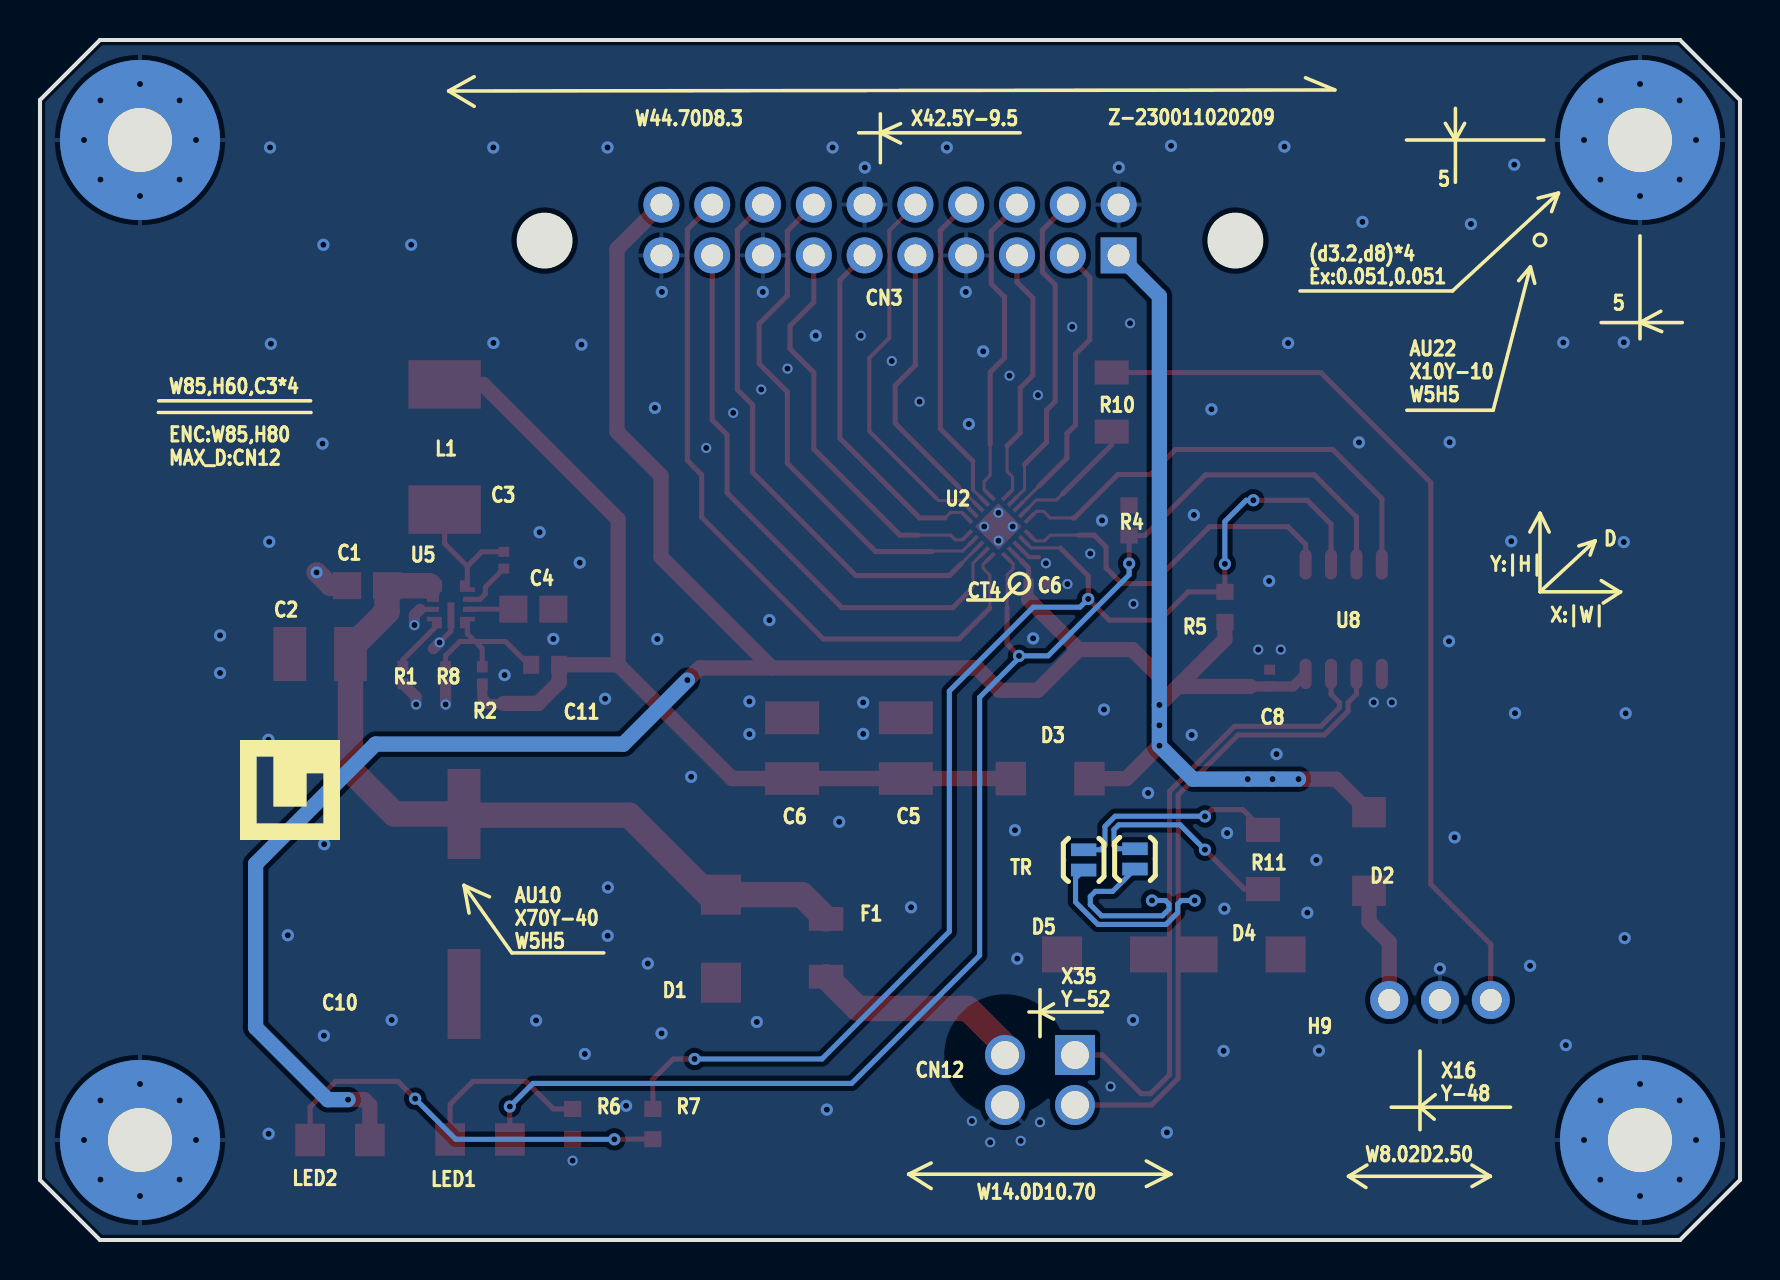
[diagram p4: board, bottom side, seen from below]

Outline 85 x 60 mm; copper layers: Top Layer, Bottom Layer. Coordinates in mm from the lower left corner of the outline.
Outline path: 0,57 3,60 82,60 85,57 85,3 82,0 3,0 0,3 0,57
Stack: Top Layer 0.035mm / Dielectric1 1.51mm FR4 er 4.5 / Bottom Layer 0.035mm

## Design rules (mm)
net VIN_7V_48V: netclass_48V
net VIN_7V_48V_AF: netclass_48V
net RS-485_B: DP1
net RS-485_A: DP1
net TR_A: DP2
net TR_B: DP2
template: Custom Config
spacing copperThickness1oz (default): track to track 0.102, other pairs 0.152 to 0.3
spacing copperThickness2oz: track to track 0.203, other pairs 0.152 to 0.3
spacing safeClearance48V: track to track 0.254, other pairs 0.203 to 1.016
track width copperThickness1oz (default): min 0.127, default 0.254, max 2.54
track width copperThickness2oz: min 0.203, default 0.254, max 2.54
differential pair differentialPair (default): width min 0.127, default 0.254, max 2.54; gap min 0.178, default 0.178
via viaSize (default): diameter min 0.5, default 0.61, max 10; hole min 0.3, default 0.305, max 6.3
net class netclass_48V uses 48V_copperRegion, copperThickness2oz, safeClearance48V
net VIN_7V_48V uses 48V_copperRegion, copperThickness2oz, safeClearance48V
net VIN_7V_48V_AF uses 48V_copperRegion, copperThickness2oz, safeClearance48V

## Placement (name value [footprint] x y rotation side)
C1  100nF  [C0805]  68.65 32.72 180 top
C2  4.7uF  [C381466]  70.99 29.3 180 top
C3  100nF  [C1525]  61.81 33.99 270 top
C4  1uF  [C0805]  60.33 31.54 0 top
C5  22uF  [C21397]  41.71 24.59 270 top
C6  22uF  [C21397]  47.4 24.59 270 top
C8  100nF  [C1525]  23.52 28.1 270 top
C9  100nF  [C1525]  35.15 32.82 180 top
C10  100uF  [CAP-SMD_BD10.0-L10.3-W10.3-FD]  63.8 16.8 270 top
C11  22pF  [C0603]  59.74 28.76 0 top
CN12  KF2EDGSRMG-3.5-2*2P  [CONN-TH_4P-P3.50_KEFA_KF2EDGSRMG-3.5-2X2P]  35 8 0 top
CN13  Z-230011020209  [IDC-TH_20P-P2.54_Z-230011020209]  42.5 50.5 180 top
D1  SMAJ48A-TR  [SMA_L4.3-W2.6-LS5.2-RD]  50.95 15.07 90 top
D2  SS14  [SMA_L4.2-W2.6-LS5.0-RD_1]  18.55 19.42 270 top
D3  SS14  [SMA_L4.2-W2.6-LS5.0-RD_1]  34.49 23.07 0 top
D4  SMAJ30CA  [SMA_L4.4-W2.8-LS5.1-BI]  24.92 14.28 0 top
D5  SMAJ30CA  [SMA_L4.4-W2.8-LS5.1-BI]  31.7 14.28 180 top
F1  JFC1206-0750FS  [F1206]  45.7 14.61 90 top
H9  PM254-1-03-W-8.5  [HDR-TH_3P-P2.54-H-F-W10.0-N]  15 12 0 top
L1  47uH  [IND-SMD_L7.0-W6.6_FXL0630]  64.77 39.65 90 top
LED1  KT-1206YG  [LED-SMD_L3.2-W1.6_E6C1206YG]  63 5.02 180 top
LED2  KT-1206YG  [LED-SMD_L3.2-W1.6_E6C1206YG]  70 5 180 top
NOREF  -  [Pad_e1064]  80 5 0 top
NOREF#2  -  [Pad_e1068]  5 55 0 top
NOREF#3  -  [Pad_e1067]  5 5 0 top
NOREF#4  -  [Pad_e1069]  80 55 0 top
R1  39.2kΩ  [R0402]  66.85 28.25 90 top
R2  100kΩ  [R0402]  62.88 28.23 90 top
R4  10kΩ  [R0603]  30.55 35.98 270 top
R5  10kΩ  [R0603]  25.76 31.65 270 top
R6  1kΩ  [R0603]  58.37 5.8 90 top
R7  1kΩ  [R0603]  54.36 5.8 270 top
R8  23.2kΩ  [R0402]  64.72 28.23 270 top
R10  1kΩ  [R1206]  31.42 41.89 90 top
R11  120Ω  [R1206]  23.85 19.03 270 top
U2  ATTINY1616-MNR  [QFN-20_L3.0-W3.0-P0.40-BL-EP1.7]  37.08 35.67 315 top
U5  LMR36506RRPER  [VQFN-9_L2.0-W2.0-P0.50-TL]  64.46 31.78 180 top
U8  THVD2410DR  [SOIC-8_L4.9-W3.9-P1.27-LS6.0-TL]  19.81 31.04 270 top
U9  -  [Jumper]  30.25 19.06 270 bottom
U10  -  [Jumper]  32.82 19 90 bottom

## Footprints (pads in the part's own frame, mm; a bottom-side part is the same pattern mirrored in y, then rotated)
C0603
  rect 0.8x0.9 smd: 1(-0.7,0) 2(0.7,0)
C0805
  rect 1.41x1.35 smd: 1(-1,0) 2(1,0)
C1525
  rect 0.5x0.54 smd: 1(-0.42,0) 2(0.42,0)
C21397
  rect 1.635x2.7 smd: 1(-1.518,0) 2(1.518,0)
C381466
  rect 1.635x2.7 smd: 1(-1.518,0) 2(1.518,0)
CAP-SMD_BD10.0-L10.3-W10.3-FD
  rect 4.5x1.65 smd: 1(-4.5,0) 2(4.5,0)
CONN-TH_4P-P3.50_KEFA_KF2EDGSRMG-3.5-2X2P
  rect 2x2 hole 1.4: 1(-1.75,1.25)
  round 2 hole 1.4: 2(-1.75,-1.25) 3(1.75,1.25) 4(1.75,-1.25)
F1206
  rect 1.19x1.728 smd: 1(-1.445,0) 2(1.445,0)
HDR-TH_3P-P2.54-H-F-W10.0-N
  round 1.9 hole 1.1: 1(-2.54,0) 2(0,0) 3(2.54,0)
IDC-TH_20P-P2.54_Z-230011020209
  rect 1.8x1.8 hole 1.1: 1(11.43,1.27)
  round 1.8 hole 1.1: 2(11.43,-1.27) 3(8.89,1.27) 4(8.89,-1.27) 5(6.35,1.27) 6(6.35,-1.27) 7(3.81,1.27) 8(3.81,-1.27) 9(1.27,1.27) 10(1.27,-1.27) 11(-1.27,1.27) 12(-1.27,-1.27) 13(-3.81,1.27) 14(-3.81,-1.27) 15(-6.35,1.27) 16(-6.35,-1.27) 17(-8.89,1.27) 18(-8.89,-1.27) 19(-11.43,1.27) 20(-11.43,-1.27)
IND-SMD_L7.0-W6.6_FXL0630
  rect 2.424x3.62 smd: 1(3.128,0) 2(-3.128,0)
Jumper
  rect 0.635x1.27 smd: 1(-0.508,0) 2(0.508,0)
LED-SMD_L3.2-W1.6_E6C1206YG
  rect 1.485x1.62 smd: 1(1.492,0) 2(-1.492,0)
Pad_e1064
  round 8 hole 3.2: 1(0,0)
Pad_e1067
  round 8 hole 3.2: 1(0,0)
Pad_e1068
  round 8 hole 3.2: 2(0,0)
Pad_e1069
  round 8 hole 3.2: 3(0,0)
QFN-20_L3.0-W3.0-P0.40-BL-EP1.7
  rect 0.2x0.665 smd: 1(-0.8,-1.407) 2(-0.4,-1.407) 3(0,-1.407) 4(0.4,-1.407) 5(0.8,-1.407) 11(0.8,1.407) 12(0.4,1.407) 13(0,1.407) 14(-0.4,1.407) 15(-0.8,1.407)
  rect 0.665x0.2 smd: 6(1.407,-0.8) 7(1.407,-0.4) 8(1.407,0) 9(1.407,0.4) 10(1.407,0.8) 16(-1.407,0.8) 17(-1.407,0.4) 18(-1.407,0) 19(-1.407,-0.4) 20(-1.407,-0.8)
  rect 1.65x1.65 smd: 21(0,0)
R0402
  rect 0.566x0.54 smd: 1(-0.433,0) 2(0.433,0)
R0603
  rect 0.806x0.864 smd: 1(-0.753,0) 2(0.753,0)
R1206
  rect 1.208x1.701 smd: 1(-1.479,0) 2(1.479,0)
SMA_L4.2-W2.6-LS5.0-RD_1
  rect 1.52x1.68 smd: 1(-1.965,0) 2(1.965,0)
SMA_L4.3-W2.6-LS5.2-RD
  rect 2x2 smd: 1(-2.2,0) 2(2.2,0)
SMA_L4.4-W2.8-LS5.1-BI
  rect 2x1.8 smd: 1(-2.2,0) 2(2.2,0)
SOIC-8_L4.9-W3.9-P1.27-LS6.0-TL
  oval 1.52x0.6 smd: 1(-2.74,1.905) 2(-2.74,0.635) 3(-2.74,-0.635) 4(-2.74,-1.905) 5(2.74,-1.905) 6(2.74,-0.635) 7(2.74,0.635) 8(2.74,1.905)
VQFN-9_L2.0-W2.0-P0.50-TL
  custom 0.75x0.575 smd: 1(-0.825,0.912) 4(-0.825,-0.912) 5(0.825,-0.912) 8(0.825,0.912)
  rect 0.6x0.25 smd: 2(-0.9,0.25) 3(-0.9,-0.25) 6(0.9,-0.25) 7(0.9,0.25)
  rect 0.35x1.3 smd: 9(0,0.55)

## Nets
As in the schematic, except:
GND_5V: C1.1 C2.1 C4.1 C5.1 C6.1 C8.1 C9.2 C10.2 CN12.4 CN13.2 CN13.7 CN13.12 CN13.15 CN13.19 D1.1 D4.1 D5.1 H9.2 NOREF.1 NOREF#2.2 NOREF#3.1 NOREF#4.3 R1.1 R4.1 R6.1 R8.2 U2.3 U2.21 U5.2 U5.9 U8.5

## Via types
v1: diameter 0.508, hole 0.305, Top Layer to Bottom Layer, 33 vias
v2: diameter 0.61, hole 0.305, Top Layer to Bottom Layer, 145 vias

## Routing (per net, layer and track width the routed paths; a pad name or vN(x,y) marks a point on that pad's centre or on a via; arc(x,y) is an arc through that point)
GND_5V: length 8.9
  Top Layer w0.203: U2.3 35.55,34.14 35.05,34.14
  Top Layer w0.254: 65.36,31.53 65.99,31.53 ; 64.46,31.23 64.46,30.44 v1(65.02,29.88)
  Top Layer w0.559: v1(66.28,30.75) 66.28,31.25 65.99,31.53 ; v1(66.19,26.78) 66.19,27.16 R1.1 ; v1(65.02,29.88) 65.33,29.57 ; R8.2 v1(64.72,26.78)
  Top Layer w1.016: C1.1 70.5,32.72 v2(71.17,33.38)
  vias: v1(17.41,26.88) v1(18.31,26.88) v1(22.96,29.52) v1(24.09,29.52) v1(30.33,31.81) v1(30.5,45.84) v1(31.47,7.68) v1(32.49,34.32) v1(33.39,45.66) v1(33.63,32.8) v1(34.7,33.84) v1(35,5.89) v1(35.1,42.25) v1(35.97,4.96) v1(36.37,35.67) v1(36.53,43.21) v1(37.08,36.36) v1(37.08,34.97) v1(37.49,4.88) v1(37.79,35.67) v1(38.41,5.95) v1(41.02,41.92) v1(42.41,43.95) v1(43.96,45.22) v1(47.62,43.57) v1(48.94,42.53) v1(50.34,41.36) v1(51.69,39.6) v1(58.37,3.97) v2(2.2,55) v2(2.2,5) v2(3.02,56.98) v2(3.02,53.02) v2(3.02,6.98) v2(3.02,3.02) v2(5,57.8) v2(5,52.2) v2(5,7.8) v2(5,2.2) v2(5.72,26.33) v2(5.81,44.88) v2(5.81,34.9) v2(5.77,15.1) v2(6.98,56.98) v2(6.98,53.02) v2(6.98,6.98) v2(6.99,3.01) v2(7.8,55) v2(7.8,5) v2(8.71,9.74) v2(8.84,44.87) v2(10.5,13.71) v2(11.25,26.34) v2(11.29,53.76) v2(11.44,34.94) v2(13.45,50.8) v2(14.27,20.13) v2(14.52,39.89) v2(14.55,29.94) v2(15.01,13.57) v2(18.88,50.9) v2(19.05,39.88) v2(21.05,9.47) v2(21.18,19) v2(21.63,16.37) v2(22.6,44.85) v2(22.78,54.67) v2(23.17,24.3) v2(23.54,32.95) v2(25.65,20.35) v2(25.78,16.57) v2(25.82,9.46) v2(26.43,41.54) v2(27.31,36.25) v2(27.41,25.25) v2(28.45,54.71) v2(28.66,5.38) v2(29.6,22.35) v2(30.35,11) v2(31.06,53.62) v2(31.8,26.52) v2(31.9,35.98) v2(35.34,30.08) v2(36.14,14.07) v2(36.25,20.49) v2(37.84,44.43) v2(38.56,40.8) v2(38.71,47.4) v2(39.66,54.63) v2(41.45,16.64) v2(43.76,53.62) v2(43.84,26.88) v2(43.84,25.3) v2(45.04,20.91) v2(45.37,54.63) v2(45.66,6.52) v2(46.21,45.22) v2(48.53,31) v2(48.86,47.4) v2(49.16,10.9) v2(49.53,26.93) v2(49.53,25.29) v2(52.44,23.16) v2(53.91,47.4) v2(53.92,10.33) v2(54.13,30.05) v2(54.25,41.61) v2(54.61,13.82) v2(55.7,6.71) v2(56.62,54.63) v2(56.61,17.63) v2(56.62,15.21) v2(56.75,27.06) v2(57.76,9.3) v2(57.93,44.77) v2(58.01,33.87) v2(59.33,30.05) v2(60.02,35.39) v2(60.2,10.98) v2(61.77,28.25) v2(62.34,54.63) v2(62.33,44.85) v2(66.44,49.76) v2(67.41,11) v2(70.83,49.76) v2(70.79,19.79) v2(70.8,10.22) v2(70.87,39.82) v2(72.61,15.24) v2(73.5,54.63) v2(73.46,44.81) v2(73.54,34.91) v2(73.58,25.01) v2(73.57,5.31) v2(76,30.23) v2(76,28.35) v2(77.2,55) v2(77.2,5) v2(78.02,56.98) v2(78.02,53.02) v2(78.02,6.98) v2(78.02,3.02) v2(80,57.8) v2(80,52.2) v2(80,7.8) v2(80,2.2) v2(81.98,56.98) v2(81.98,53.02) v2(81.98,6.98) v2(81.98,3.02) v2(82.8,55) v2(82.8,5)
VDD: length 161.4
  Top Layer w0.203: 36.36,34.39 35.92,33.95
  Top Layer w0.254: C9.1 35.57,33.6 35.92,33.94 35.92,33.95
  Top Layer w0.508: 35.57,32.02 C9.1 ; U8.8 22.34,27.68 C8.2 24.49,27.68
  Top Layer w0.762: 33.07,29.52 35.57,32.02 ; 33.07,29.52 30.38,29.52 29.03,28.17 v2(29.03,26.75) ; 33.07,29.52 35.1,27.49 37.03,27.49 38.15,28.61 48.41,28.61 ; 24.49,27.68 28.11,27.68 ; 28.11,27.68 25.76,30.03 R5.2 ; 28.11,27.68 v2(29.03,26.75) ; 48.41,28.61 53.95,34.14 53.95,38.21 56.15,40.42 56.15,49.55 CN13.20 ; 48.41,28.61 52.02,28.61 v2(52.63,28) ; v2(24.61,23.04) v2(23.37,23.04) v2(22.07,23.04) 20.2,23.04 D2.1 ; v2(69.6,7.02) 68.78,7.02 68.51,6.74 LED2.1 ; v2(29.03,26.75) v2(29.03,25.73) v2(29.03,24.72) 30.68,23.07 D3.1
  Bottom Layer w0.762: CN13.1 29.03,47.19 v2(29.03,26.75) v2(29.03,25.73) v2(29.03,24.72) 27.36,23.04 v2(24.61,23.04) v2(23.37,23.04) v2(22.07,23.04) ; v2(52.63,28) 55.83,24.8 68.22,24.8 74.22,18.8 74.22,10.62 70.61,7.02 v2(69.6,7.02)
VDD_5V3: length 49.7
  Top Layer w0.254: 61.84,26.8 61.81,26.83
  Top Layer w0.508: R2.1 62.88,27.11 62.58,26.8 61.84,26.8
  Top Layer w0.762: L1.1 62.84,42.78 56.09,36.03 56.09,28.76 ; 61.81,26.83 60.1,26.83 59.04,27.88 59.04,28.76 56.09,28.76 ; 56.09,28.76 56.09,28.74 56.06,28.74 50.4,23.08 C6.2 C5.2 36.46,23.08 D3.2
VDD_DEBUG: length 5.9
  Top Layer w0.762: D2.2 18.55,15.9 17.54,14.89 H9.3
VIN_7V_48V: length 10.8
  Top Layer w1.27: CN12.3 36.75,9.7 38.62,11.58 44.11,11.58 F1.1
VIN_7V_48V_AF: length 39.4
  Top Layer w0.381: U5.4 65.36,32.62
  Top Layer w0.635: 65.36,32.62 65.36,32.24
  Top Layer w1.27: 65.53,32.72 C1.2 67.65,31.42 69.47,29.59 C2.2 69.47,23.5 67.28,21.3 C10.1 63.74,21.24 55.54,21.24 51.57,17.27 D1.2 46.91,17.27 45.7,16.06
BOOT: length 2.6
  Top Layer w0.254: U5.6 63,32.03 62.73,32.31 62.73,32.65 C3.2
FB: length 8.1
  Top Layer w0.254: R8.1 64.72,29.22 64.01,29.93 63.25,29.93 ; 63.25,29.93 62.89,29.57 62.89,28.67 R2.2 ; 63.25,29.93 63.63,30.31 U5.8 ; 63.25,29.93 61.72,29.93 60.55,28.76 C11.2
HV_PROTECT: length 6.4
  Top Layer w0.152: 35.8,36.39 35.19,37 34.18,37 33.86,37.31
  Top Layer w0.254: R10.1 31.42,39.76 33.86,37.31
LDO_OUT: length 2.2
  Top Layer w0.254: C4.2 63.55,31.54 63.56,31.53
PA0: length 45.3
  Top Layer w0.254: H9.1 12.46,14.78 15.46,17.78 15.46,37.87 20.97,43.37 R10.2
PA1/D: length 23.6
  Top Layer w0.152: 33.35,36.1 34.49,36.1 34.82,36.43 35.19,36.43 U2.20
  Top Layer w0.254: U8.4 17.91,37.06 20.37,39.53 28.22,39.53 29.48,38.27 31.11,38.27 33.28,36.1 33.35,36.1
PA2/R: length 18.2
  Top Layer w0.152: U2.1 35.23,34.96 34.78,34.96 34.49,35.24 33.07,35.24
  Top Layer w0.254: 33.07,35.24 32.29,35.24 31.7,34.65 31.7,33.61 30.91,32.82 29.37,32.82 26.53,35.67 22.61,35.67 21.72,34.78 U8.1
PA3/RE: length 65
  Top Layer w0.152: 35.8,34.96 35.44,34.6 33.99,34.6
  Top Layer w0.254: U8.2 20.45,35.79 21.64,36.99 v2(24.33,36.99) ; v2(52.27,9.05) 53.34,9.05 54.36,8.03 R7.1 ; v2(25.76,33.8) R5.1 27.59,32.41 29.01,30.99 31.53,30.99 v2(32.59,32.05) 32.59,33.2 33.99,34.6
  Bottom Layer w0.254: v2(25.76,33.8) 25.76,35.92 24.69,36.99 v2(24.33,36.99) ; v2(32.59,32.05) 33,31.64 35.34,31.64 39.53,27.44 39.53,15.42 45.9,9.05 v2(52.27,9.05)
PA3/RE_SINK: length 20.5
  Top Layer w0.254: LED2.2 71.49,6.65 70.21,7.93 67.11,7.93 v2(66.24,7.07) ; R7.2 56.27,5.04 v2(56.28,5.03)
  Bottom Layer w0.254: v2(66.24,7.07) 64.21,5.03 v2(56.28,5.03)
PA4/DE: length 74.3
  Top Layer w0.152: 36.65,31.6 36.65,33.25 36.34,33.56 36.34,33.81 U2.5
  Top Layer w0.254: R4.2 29.75,35.22 26.72,38.26 21.28,38.26 19.18,36.15 19.18,33.78 ; 36.65,31.6 36.65,29.81 v2(36.05,29.21) ; LED1.1 v2(61.51,6.67) ; 30.54,35.02 v2(30.54,33.82)
  Bottom Layer w0.254: v2(30.54,33.82) 30.54,33.26 34.59,29.21 v2(36.05,29.21) 36.05,29.1 38.02,27.13 38.02,14.23 44.42,7.83 60.35,7.83 v2(61.51,6.67)
PA4/DE_SOURCE: length 8.9
  Top Layer w0.254: R6.2 59.33,6.55 60.71,7.93 63.35,7.93 64.49,6.78 LED1.2
PA5: length 36.8
  Top Layer w0.152: 37.51,33.23 37.51,31.59 ; 37.52,34.11 37.85,33.79 37.85,33.58 37.51,33.24
  Top Layer w0.254: CN13.18 52.63,50.53 52.63,38.97 51.92,38.26 51.92,36.13 45.83,30.05 39.05,30.05 37.51,31.59
PA6: length 29.3
  Top Layer w0.152: 37.79,34.39 38.35,33.84 38.35,32.62 38.51,32.46
  Top Layer w0.254: 38.51,32.46 39.35,31.62 44.91,31.62 50.64,37.36 50.64,40.26 51.39,41.01 CN13.17
PA7: length 28.3
  Top Layer w0.152: 38.96,33.79 U2.8
  Top Layer w0.254: CN13.16 50.13,50.49 50.13,42.52 49.37,41.75 49.37,38.38 44.22,33.22 39.53,33.22 38.96,33.79
PB0: length 16.3
  Top Layer w0.152: U2.14 38.35,37.51
  Top Layer w0.203: 38.35,37.51 38.35,38.94
  Top Layer w0.254: 38.35,38.94 39.98,40.57 39.98,50.48 CN13.8
PB1: length 14.7
  Top Layer w0.152: U2.13 39.06,37.66
  Top Layer w0.254: 39.06,37.66 42.24,40.84 42.24,42.73 41.23,43.74 CN13.9
PB2: length 19.1
  Top Layer w0.152: U2.12 38.94,36.97 40.06,36.97 40.18,37.09
  Top Layer w0.203: 40.18,37.09 43.54,40.44 43.54,44.1 42.53,45.1 42.53,50.47 CN13.10
PB3: length 17.9
  Top Layer w0.152: U2.11 38.91,36.38 39.48,36.38 39.75,36.1
  Top Layer w0.254: CN13.11 45.01,47.99 45.01,40.09 41.03,36.1 39.75,36.1
PB4: length 20.3
  Top Layer w0.152: 41.1,35.24 39.47,35.24 39.23,35.01 38.88,35.01 U2.10
  Top Layer w0.254: CN13.13 46.31,46.89 47.5,45.7 47.5,44.56 46.31,43.37 46.31,39.55 42,35.24 41.1,35.24
PB5: length 25.9
  Top Layer w0.152: 40.36,34.45 38.87,34.45 U2.9
  Top Layer w0.254: 40.39,34.42 43.22,34.42 47.63,38.83 47.63,42.41 49.05,43.82 49.05,45.8 47.63,47.22 47.63,50.45 CN13.14
PC0: length 15.9
  Top Layer w0.152: 37.49,39.78 37.49,38.23 37.79,37.93 37.79,37.52 U2.15
  Top Layer w0.254: 37.49,39.78 37.49,43.39 36.78,44.1 36.78,47.15 37.44,47.81 37.44,50.43 36.15,51.72 CN13.6
PC1: length 13.1
  Top Layer w0.152: 36.65,39.7 36.65,38.43 36.37,38.16 36.37,37.51 U2.16
  Top Layer w0.254: 36.65,39.7 35.99,40.36 35.99,42.6 35.36,43.24 35.36,47.1 36.15,47.89 CN13.5
PC2: length 16.5
  Top Layer w0.152: 36.36,36.95 35.78,37.54 35.78,38.78
  Top Layer w0.254: 35.78,38.78 34.67,39.88 34.67,41.5 34.24,41.93 34.24,47.76 34.88,48.4 34.88,50.5 CN13.4
PC3: length 14.5
  Top Layer w0.152: U2.18 35.05,37.7
  Top Layer w0.254: CN13.3 32.51,48.13 32.51,45.01 33.22,44.3 33.22,40.75 33.66,40.32 33.66,39.09 35.05,37.7
RS-485_A: length 41.7
  Top Layer w0.254: 19.18,28.3 19.18,27.29 19.6,26.87 19.6,26.44 20.78,25.25 25.09,25.25 28.09,22.26 28.09,8.08 29.42,6.75 CN12.2 ; v2(27.27,16.97) 27.93,16.97
  Bottom Layer w0.254: U10.1 33.22,18.09 33.22,16.9 32.11,15.78 28.7,15.78 28.12,16.36 28.12,16.8 27.94,16.97 v2(27.27,16.97)
RS-485_B: length 41.7
  Top Layer w0.254: 28.52,16.97 28.52,22.43 25.27,25.68 20.96,25.68 20.03,26.62 20.03,26.87 20.45,27.29 U8.7 ; 28.52,16.97 v2(29.4,16.97) ; 28.52,16.97 28.52,8.26 29.47,7.32 29.95,7.32 31.88,9.25 CN12.1
  Bottom Layer w0.254: U9.2 31.37,17.43 32.23,17.43 32.49,17.18 32.49,16.77 31.93,16.21 28.88,16.21 28.55,16.54 28.55,16.8 28.73,16.97 v2(29.4,16.97)
RT: length 2.8
  Top Layer w0.254: U5.1 65.28,30.58 66.85,29.01 R1.2
TR_A: length 10.8
  Top Layer w0.254: R11.1 24.86,21.52 26.41,21.52 v2(26.75,21.18)
  Bottom Layer w0.254: v2(26.75,21.18) 26.76,21.19 31.24,21.19 31.75,20.68 31.75,19.74 31.98,19.51 U10.2
TR_B: length 10.8
  Top Layer w0.254: R11.2 24.79,17.55 v2(26.75,19.52)
  Bottom Layer w0.254: U9.1 31.14,19.56 31.3,19.73 31.3,20.52 31.06,20.76 28,20.76 v2(26.75,19.52)
VOP: length 6.4
  Top Layer w0.254: 63.63,33.68 64.77,34.82 L1.2 ; 63.63,33.68 U5.5 ; 63.63,33.68 62.9,34.41 C3.1

## Copper pours and planes (outline as drawn; the poured copper is in the pictures)
GND_5V on Top Layer: -5.11,64.44 92.96,64.44 92.96,-6.34 -5.11,-6.34
GND_5V on Bottom Layer: -5.11,64.65 90.04,64.65 90.04,-4.9 -5.11,-4.9

## Text on the board
Bottom Silkscreen Layer: 5 | D | X16 / Y-48 | AU22 / X10Y-10 / W5H5 | D2 | W8.02D2.50 | U8 | (d3.2,d8)*4 / Ex:0.051,0.051 | H9 | C8 | R11 | D4 | R5 | R4 | Z-230011020209 | R10 | X35 / Y-52 | D3 | C6 | D5 | TR | W14.0D10.70 | CT4 | U2 | CN12 | X42.5Y-9.5 | C5 | CN3 | F1 | R7 | D1 | W44.70D8.3 | R6 | C11 | C4 | AU10 / X70Y-40 / W5H5 | C3 | R2 | R8 | L1 | LED1 | U5 | R1 | C1 | C10 | LED2 | C2 | W85,H60,C3*4 | ENC:W85,H80 | MAX_D:CN12 | X:|W| | Y:|H|
Top Silkscreen Layer: RS- / 485 | B | CORE V0 | From SASEBO / NAGASAKI / JAPAN | CT2:VOUT-GND:NS | CT8:A-GND: / >95kΩ,O.L | CT9:B-GND: / >95kΩ,O.L | CT10:VOP-BOOT / >95kΩ,O.L | CT1:VIN-GND:NS | CT3:LDO-GND:NS | CT4(R:MVCC-GND:NS | CT5:UPDI-GND:NS | CT6:485VCC-GND:NS | CT7:A-B:>95kΩ,O.L | COLD TEST | CT5 | CT7,8,9 | CN13 | PA0 | UPDI | GND | VDD | CT6 | CT2 | A | VIN | 7V~ / 48V | CT3 | CT10 | PA4/DE:AH | PA3/RE:AL | CT1 | 2026/04/30
